# Altium schematic sheet Power.SchDoc
size A
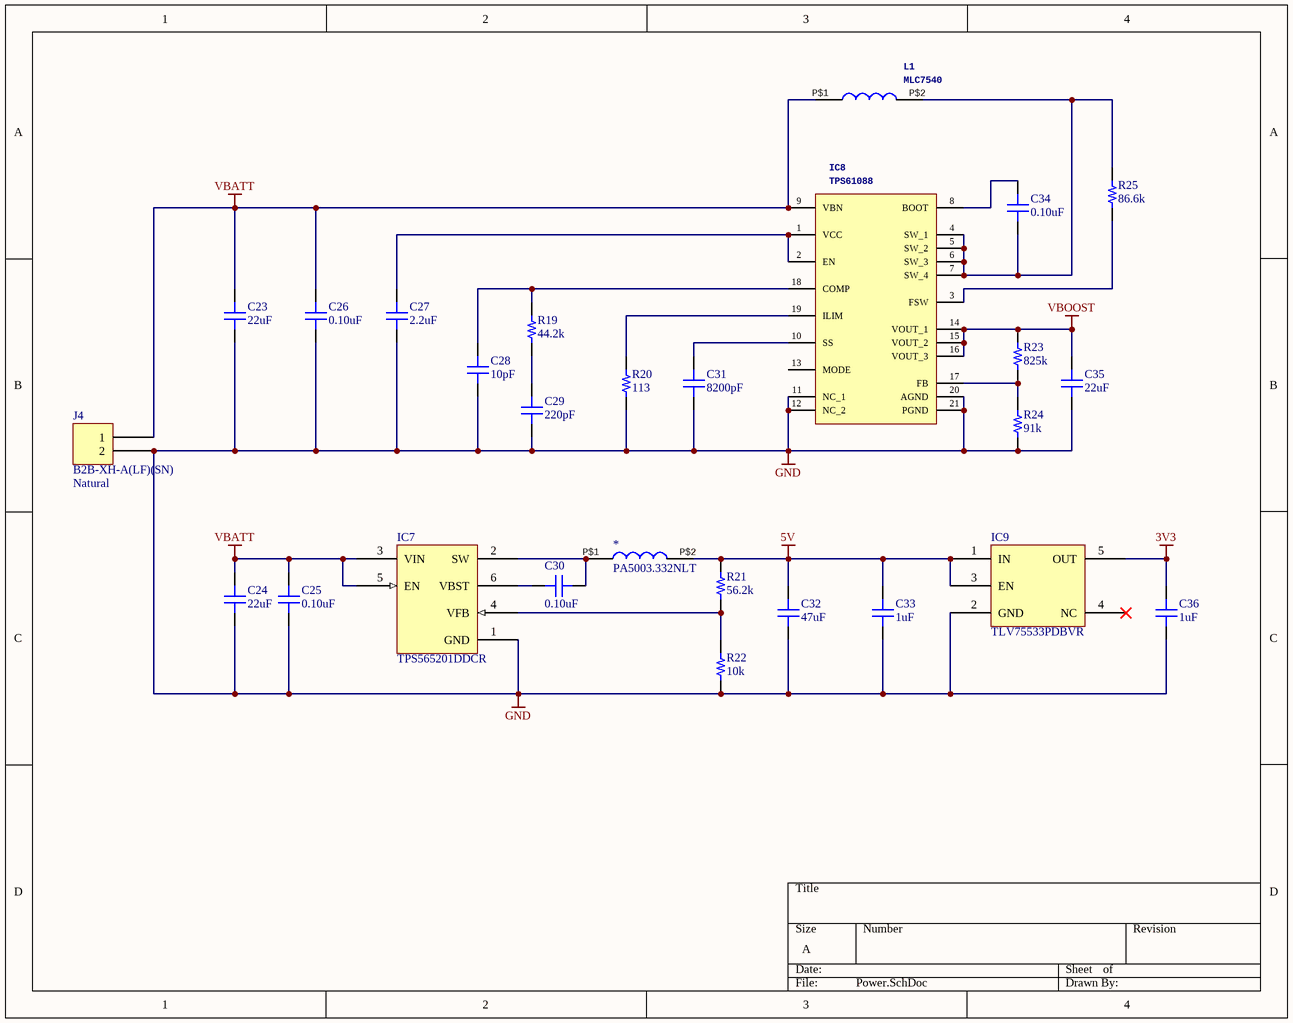
[diagram p0: Power.SchDoc]

## Parts
*  PA5003.332NLT  [PA5003]
C23  22uF  [CAP 1210/3225 - 2.8MM]
C24  22uF  [CAP 0805/2012]
C25  0.10uF  [CAP 0402/1005]
C26  0.10uF  [CAP 0603/1608]
C27  2.2uF  [CAP 0603/1608]
C28  10pF  [CAP 0402/1005]
C29  220pF  [CAP 0402/1005]
C30  0.10uF  [CAP 0402/1005]
C31  8200pF  [CAP 0603/1608]
C32  47uF  [CAP 1206/3216]
C33  1uF  [CAP 0603/1608]
C34  0.10uF  [CAP 0402/1005]
C35  22uF  [CAP 1210/3225 - 2.8MM]
C36  1uF  [CAP 0603/1608]
IC7  TPS565201DDCR  [DDC]
IC8  TPS61088  [RHL(R-PVQFN-N20)_1]
IC9  TLV75533PDBVR  [SOT95P280X145-5N]
J4  B2B-XH-A(LF)(SN)  Colour: Natural  [JST XH B2B-XH-A]
L1  MLC7540  [MLC7540]
R19  44.2k  [RES 0402/1005]
R20  113  [RES 0402/1005]
R21  56.2k  [RES 0402/1005]
R22  10k  [RES 0402/1005]
R23  825k  [RES 0402/1005]
R24  91k  [RES 0402/1005]
R25  86.6k  [RES 0402/1005]

## Nets
3V3: C36.2 IC9.5(OUT)
5V: *.P$2 C32.2 C33.2 IC9.1(IN) IC9.3(EN) R21.2
GND: C23.1 C24.1 C25.1 C26.1 C27.1 C28.1 C29.1 C31.1 C32.1 C33.1 C35.1 C36.1 IC7.1(GND) IC8.11(NC_1) IC8.12(NC_2) IC8.20(AGND) IC8.21(PGND) IC9.2(GND) J4.2 R20.1 R22.1 R24.1
VBATT: C23.2 C24.2 C25.2 C26.2 IC7.3(VIN) IC7.5(EN) IC8.9(VBN) J4.1 L1.P$1
VBOOST: C35.2 IC8.14(VOUT_1) IC8.15(VOUT_2) IC8.16(VOUT_3) R23.2
Net*_P$1: *.P$1 C30.1 IC7.2(SW)
NetC27_2: C27.2 IC8.1(VCC) IC8.2(EN)
NetC28_2: C28.2 IC8.18(COMP) R19.2
NetC29_2: C29.2 R19.1
NetC30_2: C30.2 IC7.6(VBST)
NetC31_2: C31.2 IC8.10(SS)
NetC34_1: C34.1 IC8.4(SW_1) IC8.5(SW_2) IC8.6(SW_3) IC8.7(SW_4) L1.P$2 R25.2
NetC34_2: C34.2 IC8.8(BOOT)
NetIC7_4: IC7.4(VFB) R21.1 R22.2
NetIC8_3: IC8.3(FSW) R25.1
NetIC8_17: IC8.17(FB) R23.1 R24.2
NetIC8_19: IC8.19(ILIM) R20.2

Not connected (* = marked no-connect by the designer): IC8 13(MODE); IC9 4(NC)*

## Library data of the parts
* = PA5003.332NLT: pin to pad: P$1>1 P$2>2
C23 C35 = TMK325B7226KMHT: CAP CER 22UF 25V X7R 1210; Manufacturer: Taiyo Yuden; TemperatureRange: -55C ~ 125C; Tolerance: 20%; Value: 22uF; Part Number: TMK325B7226KMHT; PartId: 19379; Supplier 1: Digi-Key; Supplier Part Number 1: 587-4337-2-ND; ComponentLink1Description: Datasheet; ComponentLink1URL: http://ds.yuden.co.jp/TYCOMPAS/ut/detail.do?productNo=TMK325B7226KMHT&fileName=TMK325B7226KMHT_SS&mode=specSheetDownload; ComponentLink2Description: Digi-Key Listing; ComponentLink2URL: https://www.digikey.com/product-detail/en/taiyo-yuden/TMK325B7226KMHT/587-4337-2-ND/5400883; TemperatureCoefficient: X7R; Voltage: 25V; Price: 0.5926; Device Package: 1210 (3225 Metric)
C24 = CL21A226MOQNNNE: CAP CER 22UF 16V X5R 0805; Manufacturer: Samsung Electro-Mechanics America, Inc.; TemperatureRange: -55C ~ 85C; Tolerance: 20%; Value: 22uF; Part Number: CL21A226MOQNNNE; PartId: 13784; Supplier 1: Digi-Key; Supplier Part Number 1: 1276-2909-2-ND; ComponentLink1Description: Datasheet; ComponentLink1URL: http://www.samsungsem.com/kr/support/product-search/mlcc/CL21A226MOQNNNE.jsp; ComponentLink2Description: Digi-Key Listing; ComponentLink2URL: https://www.digikey.com/product-detail/en/samsung-electro-mechanics-america-inc/CL21A226MOQNNNE/1276-2909-2-ND/3888567; TemperatureCoefficient: X5R; Voltage: 16V; Price: 0.1411; Device Package: 0805 (2012 Metric)
C25 = GRM155R71A104KA01D: CAP CER 0.1UF 10V X7R 0402; Manufacturer: Murata Electronics North America; TemperatureRange: -55C ~ 125C; Tolerance: 10%; Value: 0.10uF; Part Number: GRM155R71A104KA01D; PartId: 12364; Supplier 1: Digi-Key; Supplier Part Number 1: 490-6321-2-ND; ComponentLink1Description: Datasheet; ComponentLink1URL: http://www.murata.com/~/media/webrenewal/support/library/catalog/products/capacitor/mlcc/c02e.pdf; ComponentLink2Description: Digi-Key Listing; ComponentLink2URL: https://www.digikey.com/product-detail/en/murata-electronics-north-america/GRM155R71A104KA01D/490-6321-2-ND/2610881; TemperatureCoefficient: X7R; Voltage: 10V; Price: 0.0046; Device Package: 0402 (1005 Metric)
C26 = C0603C104K4RACTU: CAP CER 0.1UF 16V X7R 0603; Part Number: C0603X104K4RACTU; Manufacturer: Kemet; TemperatureRange: -55C ~ 125C; Tolerance: 10%; Value: 0.10uF; PartId: 12975; Supplier 1: Digi-Key; Supplier Part Number 1: 399-1096-2-ND; ComponentLink1Description: Datasheet; ComponentLink1URL: http://www.kemet.com/docfinder?Partnumber=C0603C104K4RACTU; ComponentLink2Description: Digi-Key Listing; ComponentLink2URL: https://www.digikey.com/product-detail/en/kemet/C0603C104K4RACTU/399-1096-2-ND/411095; TemperatureCoefficient: X7R; Voltage: 16V; Price: 0.0041; Device Package: 0603 (1608 Metric)
C27 = C1608X5R1V225K080AC: CAP CER 2.2UF 35V X5R 0603; Manufacturer: TDK Corporation; TemperatureRange: -55C ~ 85C; Tolerance: 10%; Value: 2.2uF; Part Number: C1608X5R1V225K080AC; PartId: 13143; Supplier 1: Digi-Key; Supplier Part Number 1: 445-8025-2-ND; ComponentLink1Description: Datasheet; ComponentLink1URL: https://product.tdk.com/info/en/catalog/datasheets/mlcc_commercial_general_en.pdf; ComponentLink2Description: Digi-Key Listing; ComponentLink2URL: https://www.digikey.com/product-detail/en/tdk-corporation/C1608X5R1V225K080AC/445-8025-2-ND/2792255; TemperatureCoefficient: X5R; Voltage: 35V; Price: 0.0462; Device Package: 0603 (1608 Metric)
C28 = C0402C100J3GACTU: CAP CER 10PF 25V NP0 0402; Manufacturer: Kemet; TemperatureRange: -55C ~ 125C; TemperatureCoefficient: C0G, NP0; Tolerance: 5%; Value: 10pF; Part Number: C0402C100J3GACTU; PartId: 12402; Supplier 1: Digi-Key; Supplier Part Number 1: 399-7746-2-ND; ComponentLink1Description: Datasheet; ComponentLink1URL: http://www.kemet.com/docfinder?Partnumber=C0402C100J3GACTU; ComponentLink2Description: Digi-Key Listing; ComponentLink2URL: https://www.digikey.com/product-detail/en/kemet/C0402C100J3GACTU/399-7746-2-ND/2196151; Voltage: 25V; Price: 0.0029; Device Package: 0402 (1005 Metric)
C29 = CC0402JRNPO8BN221: CAP CER 220PF 25V NPO 0402; Manufacturer: Yageo; TemperatureRange: -55C ~ 125C; TemperatureCoefficient: C0G, NP0; Tolerance: 5%; Value: 220pF; Part Number: CC0402JRNPO8BN221; PartId: 5136; Supplier 1: Digi-Key; Supplier Part Number 1: 311-1026-2-ND; ComponentLink1Description: Datasheet; ComponentLink1URL: http://www.yageo.com/documents/recent/UPY-GP_NP0_16V-to-50V_10.pdf; ComponentLink2Description: Digi-Key listing; ComponentLink2URL: http://digikey.com/product-detail/en/CC0402JRNPO8BN221/311-1026-2-ND/302760; Voltage: 25V; Price: 0.0176; Type: -; Device Package: 0402 (1005 Metric)
C30 = GRM155R71A104KA01D: CAP CER 0.1UF 10V X7R 0402; Part Number: GRM155R71E104KE14D; Manufacturer: Murata Electronics North America; TemperatureRange: -55C ~ 125C; Tolerance: 10%; Voltage: 25V; Value: 0.10uF; PartId: 12364; Supplier 1: Digi-Key; Supplier Part Number 1: 490-6321-2-ND; ComponentLink1Description: Datasheet; ComponentLink1URL: http://www.murata.com/~/media/webrenewal/support/library/catalog/products/capacitor/mlcc/c02e.pdf; ComponentLink2Description: Digi-Key Listing; ComponentLink2URL: https://www.digikey.com/product-detail/en/murata-electronics-north-america/GRM155R71A104KA01D/490-6321-2-ND/2610881; TemperatureCoefficient: X7R; Price: 0.0046; Device Package: 0402 (1005 Metric)
C31 = GRM188R71H822KA01D: CAP CER 8200PF 50V X7R 0603; Manufacturer: Murata Electronics North America; TemperatureRange: -55C ~ 125C; Tolerance: 10%; Value: 8200pF; Part Number: GRM188R71H822KA01D; PartId: 13328; Supplier 1: Digi-Key; Supplier Part Number 1: 490-1510-2-ND; ComponentLink1Description: Datasheet; ComponentLink1URL: http://www.murata.com/~/media/webrenewal/support/library/catalog/products/capacitor/mlcc/c02e.pdf; ComponentLink2Description: Digi-Key Listing; ComponentLink2URL: https://www.digikey.com/product-detail/en/murata-electronics-north-america/GRM188R71H822KA01D/490-1510-2-ND/587160; TemperatureCoefficient: X7R; Voltage: 50V; Price: 0.0154; Device Package: 0603 (1608 Metric)
C32 = CL31A476MPHNNNE: CAP CER 47UF 10V X5R 1206; Manufacturer: Samsung Electro-Mechanics America, Inc.; TemperatureRange: -55C ~ 85C; Tolerance: 20%; Value: 47uF; Part Number: CL31A476MPHNNNE; PartId: 15809; Supplier 1: Digi-Key; Supplier Part Number 1: 1276-3063-2-ND; ComponentLink1Description: Datasheet; ComponentLink1URL: //media.digikey.com/pdf/Data%20Sheets/Samsung%20PDFs/CL31A476MPHNNNE_Spec.pdf; ComponentLink2Description: Digi-Key Listing; ComponentLink2URL: https://www.digikey.com/product-detail/en/samsung-electro-mechanics-america-inc/CL31A476MPHNNNE/1276-3063-2-ND/3888721; TemperatureCoefficient: X5R; Voltage: 10V; Price: 0.2455; Device Package: 1206 (3216 Metric)
C33 C36 = CL10F105ZP8NNNC: CAP CER 1UF 10V Y5V 0603; Manufacturer: Samsung Electro-Mechanics America, Inc.; TemperatureRange: -30C ~ 85C; TemperatureCoefficient: Y5V (F); Tolerance: -20%, +80%; Value: 1uF; Part Number: CL10F105ZP8NNNC; PartId: 13159; Supplier 1: Digi-Key; Supplier Part Number 1: 1276-1041-2-ND; ComponentLink1Description: Datasheet; ComponentLink1URL: http://www.samsungsem.com/kr/support/product-search/mlcc/CL10F105ZP8NNNC.jsp; ComponentLink2Description: Digi-Key Listing; ComponentLink2URL: https://www.digikey.com/product-detail/en/samsung-electro-mechanics-america-inc/CL10F105ZP8NNNC/1276-1041-2-ND/3886699; Voltage: 10V; Price: 0.006; Device Package: 0603 (1608 Metric)
C34 = GRM155R61C104KA88D: CAP CER 0.1UF 16V X5R 0402; Manufacturer: Murata Electronics North America; TemperatureRange: -55C ~ 85C; Tolerance: 10%; Value: 0.10uF; Part Number: GRM155R61C104KA88D; PartId: 12359; Supplier 1: Digi-Key; Supplier Part Number 1: 490-5415-2-ND; ComponentLink1Description: Datasheet; ComponentLink1URL: http://www.murata.com/~/media/webrenewal/support/library/catalog/products/capacitor/mlcc/c02e.pdf; ComponentLink2Description: Digi-Key Listing; ComponentLink2URL: https://www.digikey.com/product-detail/en/murata-electronics-north-america/GRM155R61C104KA88D/490-5415-2-ND/2175201; TemperatureCoefficient: X5R; Voltage: 16V; Price: 0.0027; Device Package: 0402 (1005 Metric)
IC8 = TPS61088RHLR: MANUFACTURER_NAME: Texas Instruments; GateName_1: G$1; SymbolName_1: TPS61088RHLR; LibraryName: micromousev2Parts; DeviceSetName: TPS61088RHLR; Package: RHL(R-PVQFN-N20)_1; ARROW_PART_NUMBER: TPS61088RHLR; ARROW_PRICE/STOCK: https://www.arrow.com/en/products/tps61088rhlr/texas-instruments; HEIGHT: mm; MANUFACTURER_PART_NUMBER: TPS61088RHLR
J4 = B2B-XH-A(LF)(SN): CONN HEADER XH TOP 2POS 2.5MM; Manufacturer: JST Sales America Inc.; Pitch: 0.098" (2.50mm); Number Of Positions: 2; Part Number: B2B-XH-A(LF)(SN); PartId: 16449; Supplier 1: Digi-Key; Supplier Part Number 1: 455-2247-ND; ComponentLink1Description: Datasheet; ComponentLink1URL: http://www.jst-mfg.com/product/pdf/eng/eXH.pdf; ComponentLink2Description: Digi-Key Listing; ComponentLink2URL: http://www.digikey.com/product-detail/en/jst-sales-america-inc/B2B-XH-A(LF)(SN)/455-2247-ND/1651045; Price: 0.15; Type: Header, Shrouded; Contact Finish: Tin; Fastening Type: Detent Lock; Number Of Rows: 1; Series: XH
L1 = MLC7540: GateName_1: G$1; SymbolName_1: SDR0302-1R2ML; LibraryName: micromousev2Parts; DeviceSetName: MLC7540; Package: MLC7540
R19 = ERJ-2RKF4422X: RES SMD 44.2K OHM 1% 1/10W 0402; Manufacturer: Panasonic Electronic Components; TemperatureRange: -55C ~ 155C; TemperatureCoefficient: 100ppm/C; PowerRating: 0.1W, 1/10W; Value: 44.2k; Part Number: ERJ-2RKF4422X; PartId: 253; Supplier 1: Digi-Key; Supplier Part Number 1: P44.2KLTR-ND; ComponentLink1Description: Datasheet; ComponentLink1URL: http://industrial.panasonic.com/www-cgi/jvcr13pz.cgi?E+PZ+3+AOA0002+ERJ2RKF4422X+7+WW; ComponentLink2Description: Digikey listing; ComponentLink2URL: http://digikey.com/product-detail/en/ERJ-2RKF4422X/P44.2KLTR-ND/192363; Tolerance: 1%; Price: 0.0043; Type: Thick Film; Device Package: 0402 (1005 Metric)
R20 = ERJ-2RKF1130X: RES SMD 113 OHM 1% 1/10W 0402; Manufacturer: Panasonic Electronic Components; TemperatureRange: -55C ~ 155C; TemperatureCoefficient: 100ppm/C; PowerRating: 0.1W, 1/10W; Value: 113; Part Number: ERJ-2RKF1130X; PartId: 43; Supplier 1: Digi-Key; Supplier Part Number 1: P113LTR-ND; ComponentLink1Description: Datasheet; ComponentLink1URL: http://industrial.panasonic.com/www-cgi/jvcr13pz.cgi?E+PZ+3+AOA0002+ERJ2RKF1130X+7+WW; ComponentLink2Description: Digikey listing; ComponentLink2URL: http://digikey.com/product-detail/en/ERJ-2RKF1130X/P113LTR-ND/192098; Tolerance: 1%; Price: 0.0035; Type: Thick Film; Device Package: 0402 (1005 Metric)
R21 = RC0402FR-070RL: RES SMD 0.0OHM JUMPER 1/16W 0402; Part Number: RC0402FR-0756K2L; Manufacturer: Yageo; TemperatureRange: -55C ~ 155C; PowerRating: 0.063W, 1/16W; Value: 56.2k; PartId: 16137; Supplier 1: Digi-Key; Supplier Part Number 1: 311-0.0LRTR-ND; ComponentLink1Description: Datasheet; ComponentLink1URL: http://www.yageo.com/documents/recent/PYu-RC_Group_51_RoHS_L_04.pdf; ComponentLink2Description: Digi-Key Listing; ComponentLink2URL: https://www.digikey.com/product-detail/en/yageo/RC0402FR-070RL/311-0.0LRTR-ND/2827570; Tolerance: Jumper; Price: 0.0022; Device Package: 0402 (1005 Metric)
R22 = RC0402FR-070RL: RES SMD 0.0OHM JUMPER 1/16W 0402; Part Number: RC0402JR-1310KL; Manufacturer: Yageo; TemperatureRange: -55C ~ 155C; PowerRating: 0.063W, 1/16W; Value: 10k; PartId: 16137; Supplier 1: Digi-Key; Supplier Part Number 1: 311-0.0LRTR-ND; ComponentLink1Description: Datasheet; ComponentLink1URL: http://www.yageo.com/documents/recent/PYu-RC_Group_51_RoHS_L_04.pdf; ComponentLink2Description: Digi-Key Listing; ComponentLink2URL: https://www.digikey.com/product-detail/en/yageo/RC0402FR-070RL/311-0.0LRTR-ND/2827570; Tolerance: Jumper; Price: 0.0022; Device Package: 0402 (1005 Metric)
R23 = ERJ-2RKF8253X: RES SMD 825K OHM 1% 1/10W 0402; Manufacturer: Panasonic Electronic Components; TemperatureRange: -55C ~ 155C; TemperatureCoefficient: 100ppm/C; PowerRating: 0.1W, 1/10W; Value: 825k; Part Number: ERJ-2RKF8253X; PartId: 136; Supplier 1: Digi-Key; Supplier Part Number 1: P825KLTR-ND; ComponentLink1Description: Datasheet; ComponentLink1URL: http://industrial.panasonic.com/www-cgi/jvcr13pz.cgi?E+PZ+3+AOA0002+ERJ2RKF8253X+7+WW; ComponentLink2Description: Digikey listing; ComponentLink2URL: http://digikey.com/product-detail/en/ERJ-2RKF8253X/P825KLTR-ND/192492; Tolerance: 1%; Price: 0.0035; Type: Thick Film; Device Package: 0402 (1005 Metric)
R24 = ERJ-2RKF9102X: RES SMD 91K OHM 1% 1/10W 0402; Manufacturer: Panasonic Electronic Components; TemperatureRange: -55C ~ 155C; TemperatureCoefficient: 100ppm/C; PowerRating: 0.1W, 1/10W; Value: 91k; Part Number: ERJ-2RKF9102X; PartId: 384; Supplier 1: Digi-Key; Supplier Part Number 1: P91.0KLTR-ND; ComponentLink1Description: Datasheet; ComponentLink1URL: http://industrial.panasonic.com/www-cgi/jvcr13pz.cgi?E+PZ+3+AOA0002+ERJ2RKF9102X+7+WW; ComponentLink2Description: Digikey listing; ComponentLink2URL: http://digikey.com/product-detail/en/ERJ-2RKF9102X/P91.0KLTR-ND/1746293; Tolerance: 1%; Price: 0.0043; Type: Thick Film; Device Package: 0402 (1005 Metric)
R25 = ERJ-2RKF8662X: RES SMD 86.6K OHM 1% 1/10W 0402; Manufacturer: Panasonic Electronic Components; TemperatureRange: -55C ~ 155C; TemperatureCoefficient: 100ppm/C; PowerRating: 0.1W, 1/10W; Value: 86.6k; Part Number: ERJ-2RKF8662X; PartId: 489; Supplier 1: Digi-Key; Supplier Part Number 1: P86.6KLTR-ND; ComponentLink1Description: Datasheet; ComponentLink1URL: http://industrial.panasonic.com/www-cgi/jvcr13pz.cgi?E+PZ+3+AOA0002+ERJ2RKF8662X+7+WW; ComponentLink2Description: Digikey listing; ComponentLink2URL: http://digikey.com/product-detail/en/ERJ-2RKF8662X/P86.6KLTR-ND/192498; Tolerance: 1%; Price: 0.0043; Type: Thick Film; Device Package: 0402 (1005 Metric)